# EAGLE schematic icst-button (EAGLE 9.6.2)
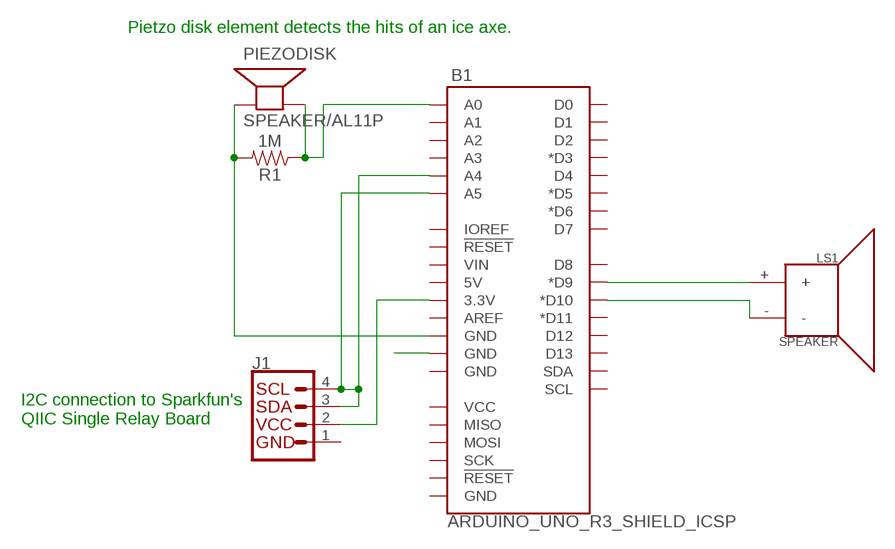
[diagram p0: schematic, sheet 1]

## Parts
B1  ARDUINO_UNO_R3_SHIELD_ICSP  [UNO_R3_SHIELD_ICSP]
J1  QWIIC_CONNECTORJS-1MM  [1X04_1MM_RA]
LS1  SPEAKER  [PCB_MOUNT_SPEAKER]
PIEZODISK  SPEAKER/AL11P  [AL11P]
R1  1M  1MOHM-0603-1/4W-5%  [0603]

## Nets
N$1: B1.D9(*D9) LS1.+
N$2: B1.D10(*D10) LS1.-
N$3: B1.GND@2(GND) PIEZODISK.+ R1.2
N$4: B1.A0 PIEZODISK.- R1.1
N$5: B1.A4 B1.A5 J1.3(SDA) J1.4(SCL)
N$7: B1.3.3V J1.2(VCC)
N$8: B1.GND@1(GND)
Unconnected: B1.5V B1.5V_ICSP(VCC) B1.A1 B1.A2 B1.A3 B1.AREF B1.D2 B1.D3(*D3) B1.D4 B1.D5(*D5) B1.D6(*D6) B1.D7 B1.D8 B1.D11(*D11) B1.D12 B1.D13 B1.GND@0(GND) B1.GND_ICSP(GND) B1.IOREF B1.MISO B1.MOSI B1.RES(!RESET!) B1.RST_ICSP(!RESET!) B1.RX(D0) B1.SCK B1.SCL B1.SDA B1.TX(D1) B1.VIN

## Notes on the sheet
- Pietzo disk element detects the hits of an ice axe.
- I2C connection to Sparkfun's
  QIIC Single Relay Board

## Power pins joined to a net without a drawn wire
GND: J1.1(GND)

## Library data of the parts
B1 = SparkFun-Boards:ARDUINO_UNO_R3_SHIELD_ICSP: Arduino R3 Shield Footprint with ICSP Header Includes pins for 6-pin (2x3) ICSP Header. Compatible with Leonardo boards that require SPI pin connections via this header. SparkFun Products: CryptoShield <https://www.sparkfun.com/products/13183> microSD Shield <https://www.sparkfun.com/products/12761> R3 Stackable Headers Kit <https://www.sparkfun.com/products/1417>
J1 = SparkFun-Connectors:QWIIC_CONNECTOR: SparkFun I2C Standard Qwiic Connector An SMD 1mm pitch JST connector makes it easy and quick (get it? Qwiic?) to connect I2C devices to each other. The Qwiic system <http://www.sparkfun.com/qwiic> enables fast and solderless connection between popular platforms and various sensors and actuators. We carry 200mm <https://www.sparkfun.com/products/14204>, 100mm <https://www.sparkfun.com/products/14205>, 50mm <https://www.sparkfun.com/products/14206>, and breadboard friendly <https://www.sparkfun.com/products/14207> Qwiic cables. We also offer 10 pcs strips <https://www.sparkfun.com/products/14323> the SMD connectors.
LS1 = SparkFun-Electromechanical:SPEAKER: Speaker Generic 2-terminal loudspeakers SparkFun Products Speaker - PCB Mount <https://www.sparkfun.com/products/11089> (COM-11089); PROD_ID: COMP-11789; SF_SKU: COM-11089
PIEZODISK = adafruit:SPEAKER: SPEAKER Source: Buerklin Added PS12 (for part # PS1240 piezo) http://www.ladyada.net/library/pcb/eaglelibrary.html
R1 = SparkFun-Resistors:1MOHM: 1MΩ resistor A resistor is a passive two-terminal electrical component that implements electrical resistance as a circuit element. Resistors act to reduce current flow, and, at the same time, act to lower voltage levels within circuits. - Wikipedia; PROD_ID: RES-07868